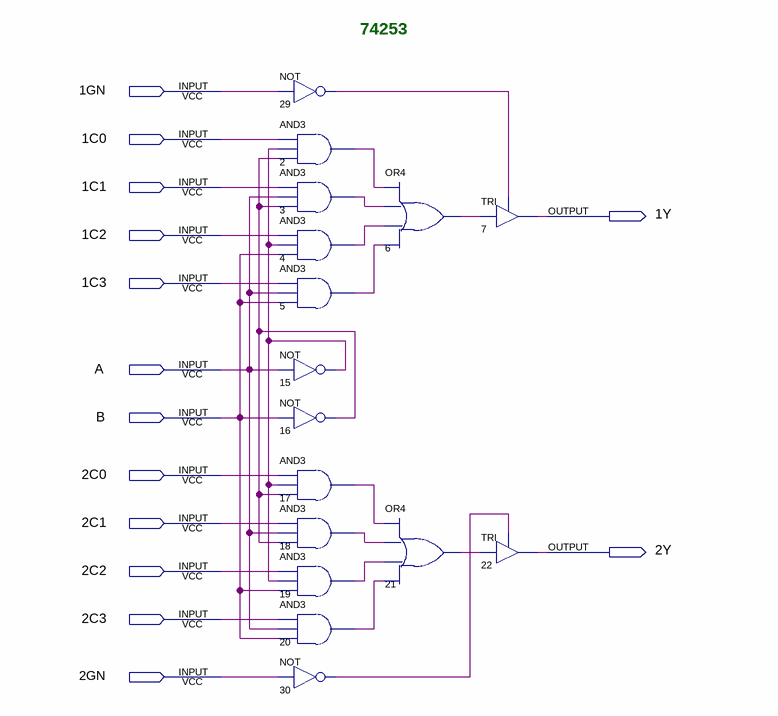
[diagram p0: schematic sheet]
// Quartus schematic 74253.bdf as structural Verilog: 16 symbols, 14 pins
module \74253  (
  input  \1GN ,
  input  \1C0 ,
  input  \1C1 ,
  input  \1C2 ,
  input  \1C3 ,
  input  A,
  input  B,
  input  \2C0 ,
  input  \2C1 ,
  input  \2C2 ,
  input  \2C3 ,
  input  \2GN ,
  output \1Y ,
  output \2Y 
);

  wire n2_out, n3_out, n4_out, n5_out, n6_out, n15_out, n16_out, n17_out, n18_out, n19_out, n20_out, n21_out,
       n29_out, n30_out;

  not u_29 (n29_out, \1GN );
  and u_2 (n2_out, \1C0 , n15_out, n16_out);
  and u_3 (n3_out, \1C1 , A, n16_out);
  and u_4 (n4_out, \1C2 , n15_out, B);
  and u_5 (n5_out, \1C3 , A, B);
  not u_15 (n15_out, A);
  not u_16 (n16_out, B);
  and u_17 (n17_out, \2C0 , n15_out, n16_out);
  and u_18 (n18_out, \2C1 , A, n16_out);
  and u_19 (n19_out, \2C2 , n15_out, B);
  and u_20 (n20_out, \2C3 , A, B);
  not u_30 (n30_out, \2GN );
  or u_6 (n6_out, n2_out, n3_out, n4_out, n5_out);
  or u_21 (n21_out, n17_out, n18_out, n19_out, n20_out);
  TRI u_7 (.IN(n6_out), .OE(n29_out), .OUT(\1Y ));
  TRI u_22 (.IN(n21_out), .OE(n30_out), .OUT(\2Y ));

  // Notes on the sheet:
  //   74253
endmodule
